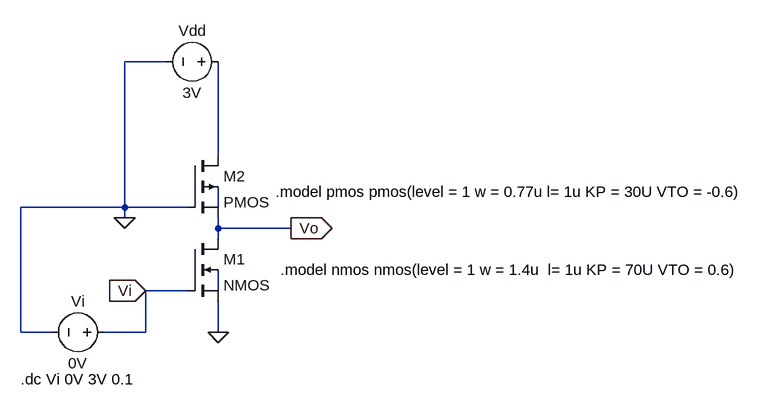
[diagram p0: schematic pseudo_nmos.asc]
pseudo_nmos.asc, the LTspice schematic file:
Version 4
SHEET 1 1008 680
WIRE -32 -32 -96 -32
WIRE 48 112 48 -32
WIRE -96 192 -96 -32
WIRE -96 192 -256 192
WIRE 0 192 -96 192
WIRE 48 192 48 160
WIRE -96 208 -96 192
WIRE 48 224 48 208
WIRE 160 224 48 224
WIRE 48 240 48 224
WIRE 0 320 -64 320
WIRE 48 320 48 288
WIRE -256 384 -256 192
WIRE -208 384 -256 384
WIRE -64 384 -64 320
WIRE -64 384 -128 384
WIRE 48 384 48 336
FLAG -96 208 0
FLAG 48 384 0
FLAG -64 320 Vi
IOPIN -64 320 In
FLAG 160 224 Vo
IOPIN 160 224 Out
SYMBOL voltage 64 -32 R90
WINDOW 0 -32 56 VBottom 2
WINDOW 3 32 56 VTop 2
SYMATTR InstName Vdd
SYMATTR Value 3V
SYMBOL voltage -112 384 R90
WINDOW 0 -32 56 VBottom 2
WINDOW 3 32 56 VTop 2
SYMATTR InstName Vi
SYMATTR Value 0V
SYMBOL nmos4 0 240 R0
SYMATTR InstName M1
SYMATTR Value2 l=1u w=1.4u
SYMBOL pmos4 0 112 R0
SYMATTR InstName M2
SYMATTR Value2 l=1U w=0.77U
TEXT -256 456 Left 2 !.dc Vi 0V 3V 0.1
TEXT 136 168 Left 2 !.model pmos pmos(level = 1 w = 0.77u l= 1u KP = 30U VTO = -0.6)
TEXT 144 288 Left 2 !.model nmos nmos(level = 1 w = 1.4u  l= 1u KP = 70U VTO = 0.6)

The netlist it stands for:
* pseudo_nmos.asc
Vdd N001 0 3V
Vi Vi 0 0V
M1 Vo Vi 0 N003 NMOS l=1u w=1.4u
M2 N001 0 Vo N002 PMOS l=1U w=0.77U
.model NMOS NMOS
.model PMOS PMOS
.lib standard.mos
.dc Vi 0V 3V 0.1
.model pmos pmos(level = 1 w = 0.77u l= 1u KP = 30U VTO = -0.6)
.model nmos nmos(level = 1 w = 1.4u  l= 1u KP = 70U VTO = 0.6)
.backanno
.end

* Results of the author's LTspice run, read from the files saved beside the schematic
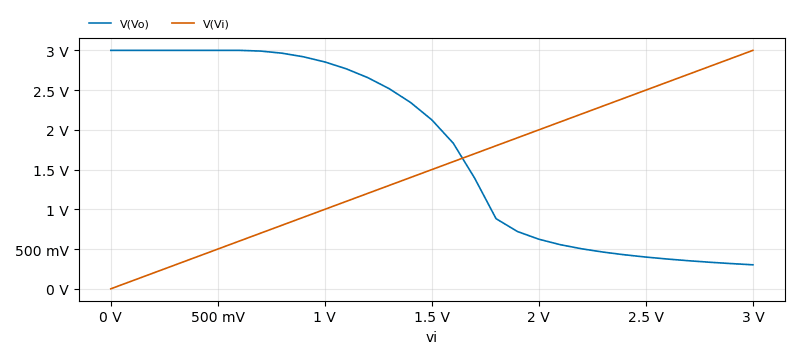
[diagram p1: DC transfer characteristic of pseudo_nmos.asc, plotted from the saved traces]
* DC transfer characteristic, 1 run:
*   V(Vo): 3 V at vi=0 V, 301.8 mV at vi=3 V, min 301.8 mV, max 3 V
*   V(Vi): 0 V at vi=0 V, 3 V at vi=3 V, min 0 V, max 3 V